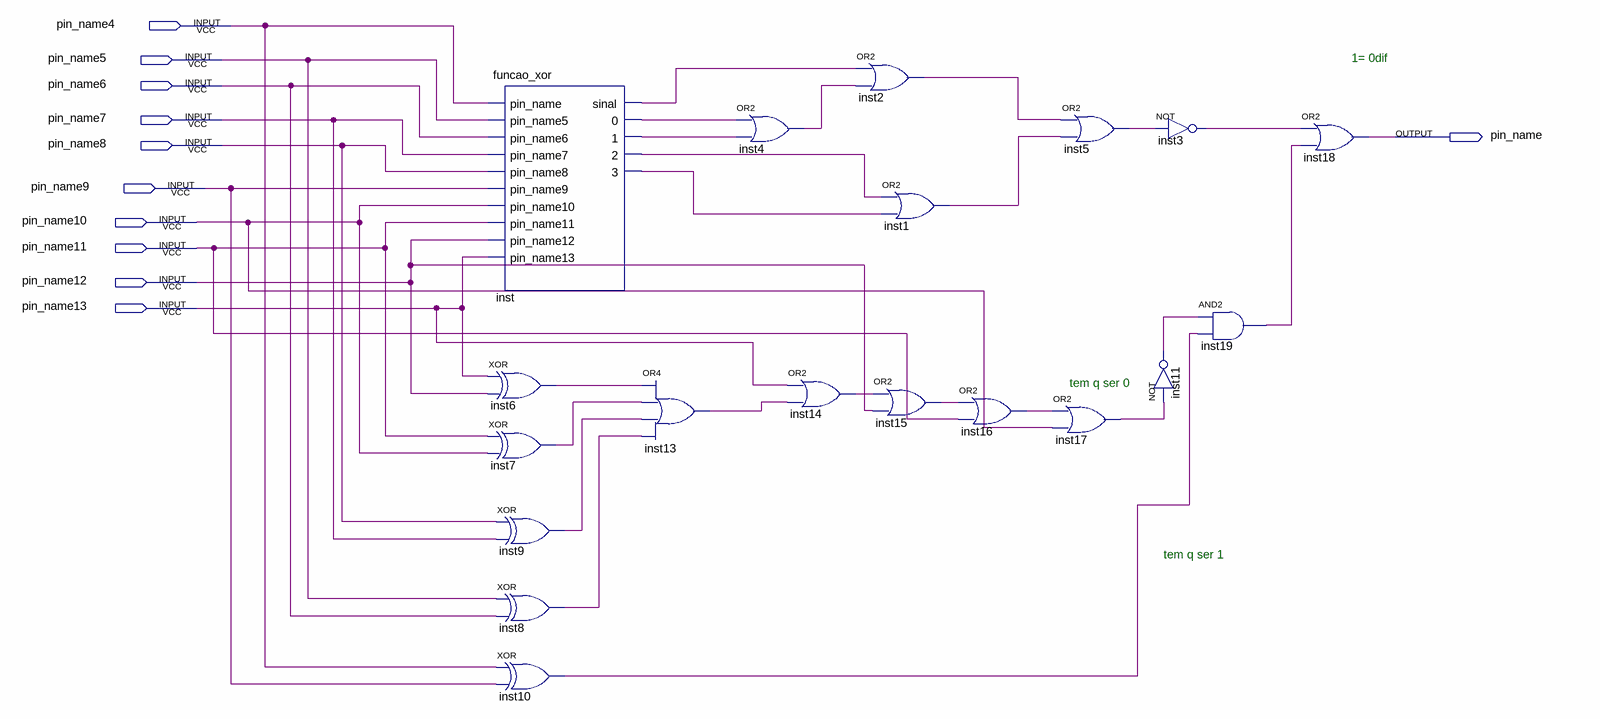
[diagram p0: schematic sheet]
// Quartus schematic funcao_igual.bdf as structural Verilog: 19 symbols, 11 pins
module funcao_igual (
  input  pin_name4,
  input  pin_name5,
  input  pin_name6,
  input  pin_name7,
  input  pin_name8,
  input  pin_name9,
  input  pin_name10,
  input  pin_name11,
  input  pin_name12,
  input  pin_name13,
  output pin_name
);

  wire inst1_out, inst2_out, inst3_out, inst4_out, inst5_out, inst6_out, inst7_out, inst8_out, inst9_out,
       inst10_out, inst11_out, inst13_out, inst14_out, inst15_out, inst16_out, inst17_out, inst19_out,
       inst_0, inst_1, inst_2, inst_3, inst_sinal;

  funcao_xor inst (
    .pin_name(pin_name4), .pin_name5(pin_name5), .pin_name6(pin_name6), .pin_name7(pin_name7),
    .pin_name8(pin_name8), .pin_name9(pin_name9), .pin_name10(pin_name10), .pin_name11(pin_name11),
    .pin_name12(pin_name12), .pin_name13(pin_name13), .sinal(inst_sinal), .\0 (inst_0), .\1 (inst_1),
    .\2 (inst_2), .\3 (inst_3));
  xor inst6 (inst6_out, pin_name13, pin_name12);
  xor inst7 (inst7_out, pin_name11, pin_name10);
  xor inst9 (inst9_out, pin_name8, pin_name7);
  xor inst8 (inst8_out, pin_name5, pin_name6);
  xor inst10 (inst10_out, pin_name4, pin_name9);
  or inst13 (inst13_out, inst6_out, inst7_out, inst9_out, inst8_out);
  or inst4 (inst4_out, inst_0, inst_1);
  or inst14 (inst14_out, pin_name13, inst13_out);
  or inst2 (inst2_out, inst_sinal, inst4_out);
  or inst1 (inst1_out, inst_2, inst_3);
  or inst15 (inst15_out, inst14_out, pin_name12);
  or inst16 (inst16_out, inst15_out, pin_name11);
  or inst5 (inst5_out, inst2_out, inst1_out);
  or inst17 (inst17_out, inst16_out, pin_name10);
  not inst3 (inst3_out, inst5_out);
  not inst11 (inst11_out, inst17_out);
  and inst19 (inst19_out, inst11_out, inst10_out);
  or inst18 (pin_name, inst3_out, inst19_out);

  // Notes on the sheet:
  //   1= 0dif
  //   tem q ser 0
  //   tem q ser 1
endmodule
